# Altium schematic sheet PA_Encoder.SchDoc
size A1
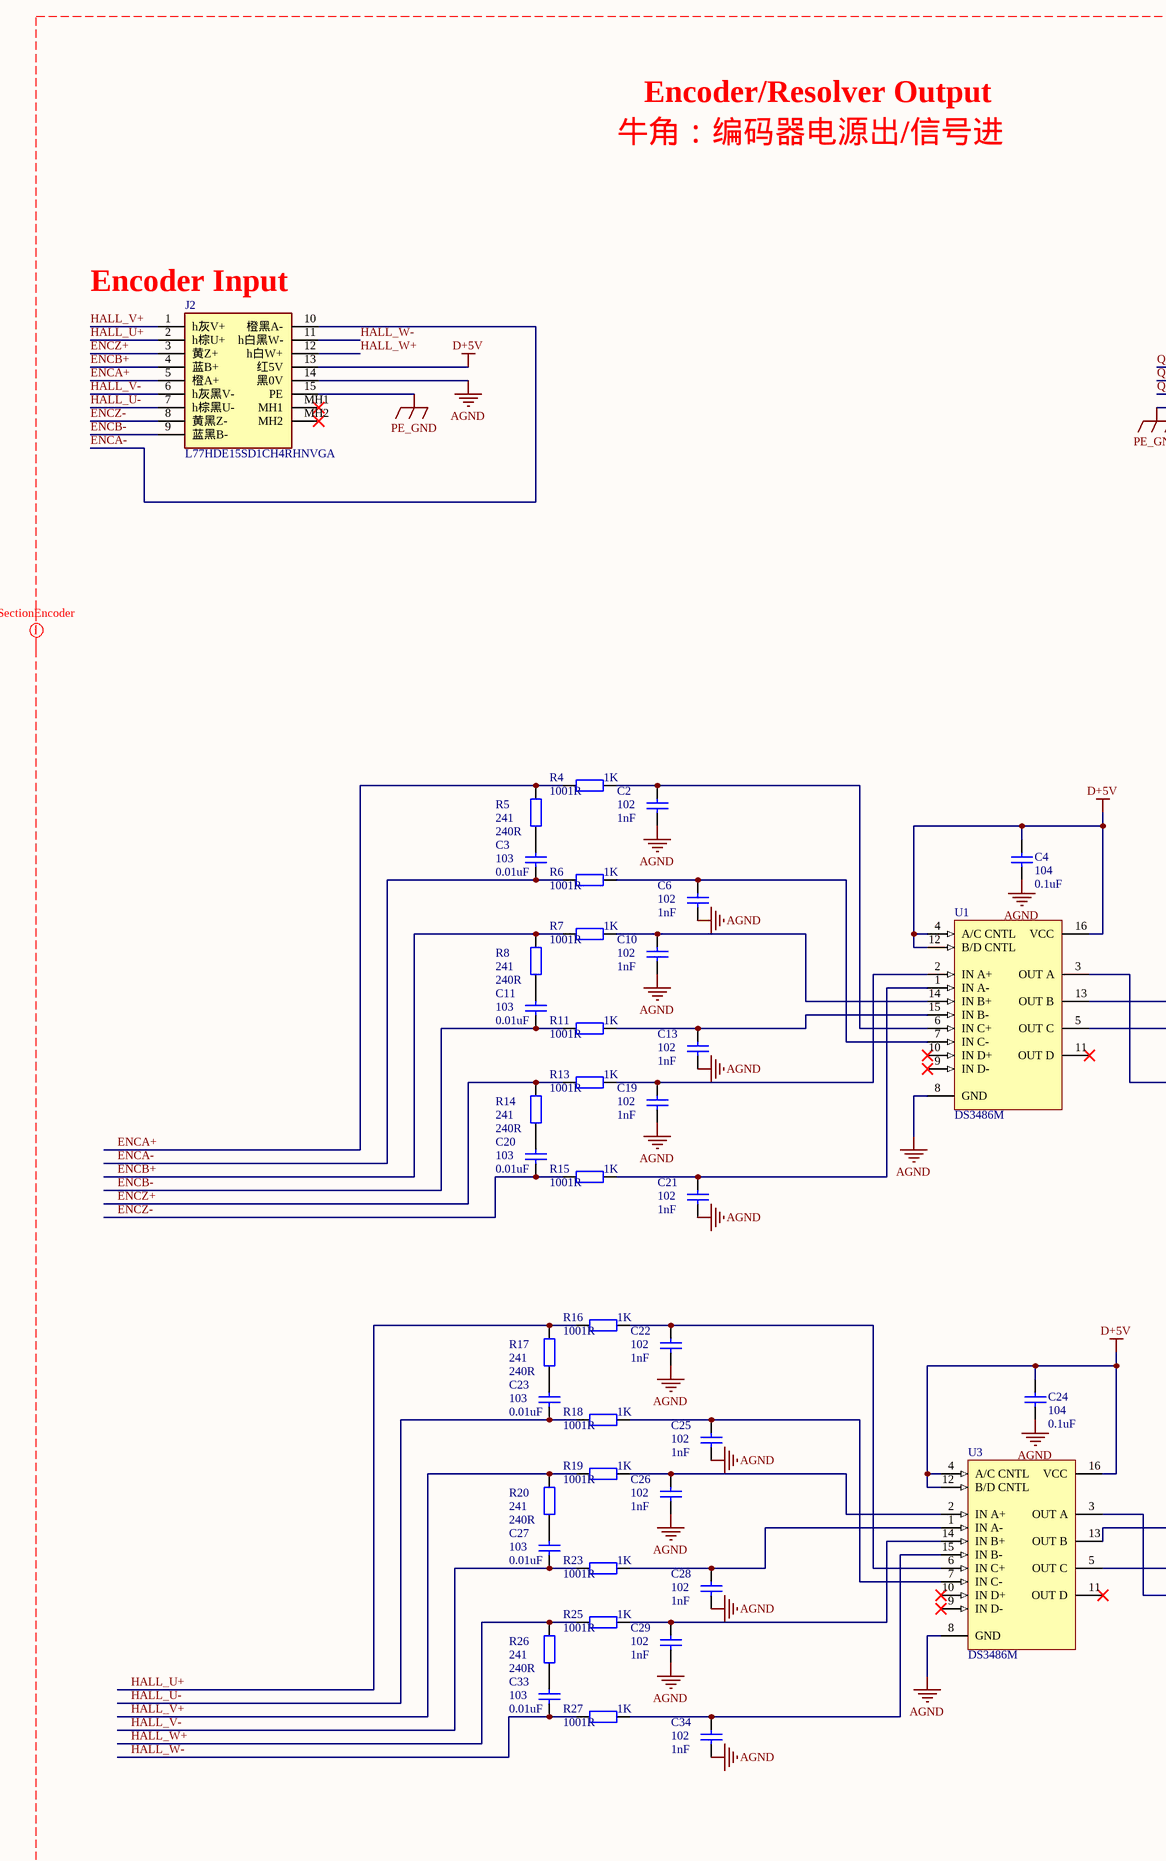
[diagram p0: PA_Encoder.SchDoc, left]
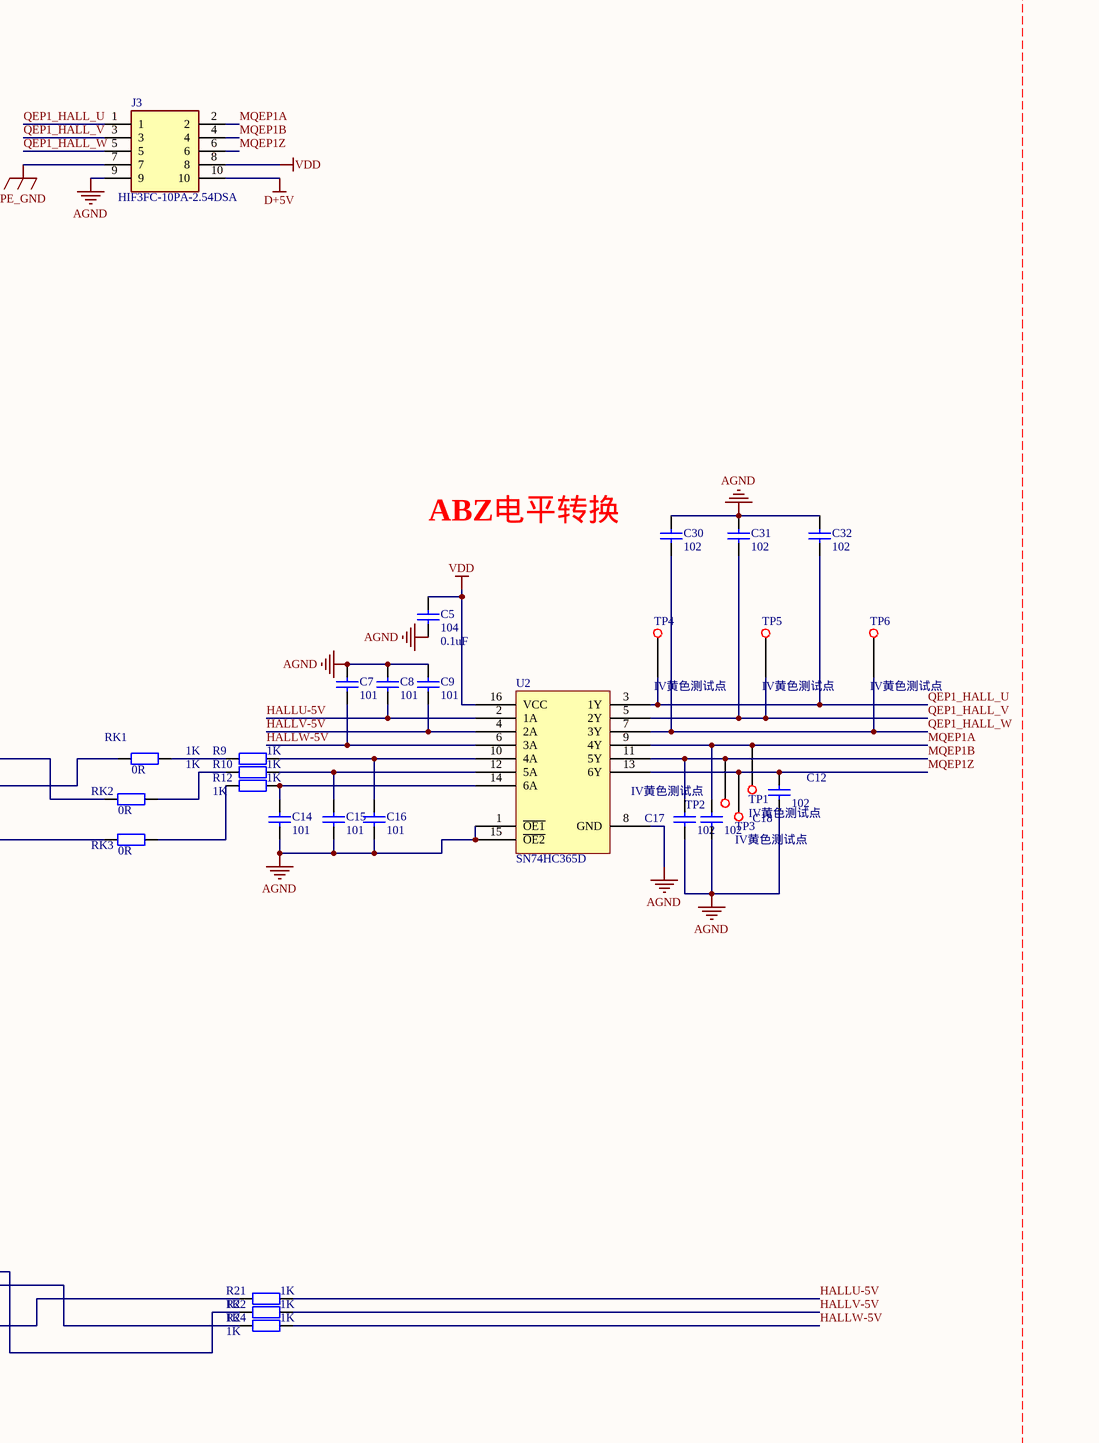
[diagram p1: PA_Encoder.SchDoc, middle]

## Parts
C2  102  value 1nF  [0805]
C3  103  value 0.01uF  [0805]
C4  104  value 0.1uF  [0805]
C5  104  value 0.1uF  [0805]
C6  102  value 1nF  [0805]
C7  101  [0805]
C8  101  [0805]
C9  101  [0805]
C10  102  value 1nF  [0805]
C11  103  value 0.01uF  [0805]
C12  102  [0805]
C13  102  value 1nF  [0805]
C14  101  [0805]
C15  101  [0805]
C16  101  [0805]
C17  102  [0805]
C18  102  [0805]
C19  102  value 1nF  [0805]
C20  103  value 0.01uF  [0805]
C21  102  value 1nF  [0805]
C22  102  value 1nF  [0805]
C23  103  value 0.01uF  [0805]
C24  104  value 0.1uF  [0805]
C25  102  value 1nF  [0805]
C26  102  value 1nF  [0805]
C27  103  value 0.01uF  [0805]
C28  102  value 1nF  [0805]
C29  102  value 1nF  [0805]
C30  102  [0805]
C31  102  [0805]
C32  102  [0805]
C33  103  value 0.01uF  [0805]
C34  102  value 1nF  [0805]
J2  L77HDE15SD1CH4RHNVGA  [L77hde15sd1ch4rhnvga]
J3  HIF3FC-10PA-2.54DSA  [HIF3FC-10PA-2.54DSA]
R4  1001R  value 1K  [0805]
R5  241  value 240R  [0805]
R6  1001R  value 1K  [0805]
R7  1001R  value 1K  [0805]
R8  241  value 240R  [0805]
R9  1K  [0805]
R10  1K  [0805]
R11  1001R  value 1K  [0805]
R12  1K  [0805]
R13  1001R  value 1K  [0805]
R14  241  value 240R  [0805]
R15  1001R  value 1K  [0805]
R16  1001R  value 1K  [0805]
R17  241  value 240R  [0805]
R18  1001R  value 1K  [0805]
R19  1001R  value 1K  [0805]
R20  241  value 240R  [0805]
R21  1K  [0805]
R22  1K  [0805]
R23  1001R  value 1K  [0805]
R24  1K  [0805]
R25  1001R  value 1K  [0805]
R26  241  value 240R  [0805]
R27  1001R  value 1K  [0805]
RK1  0R  [0805]
RK2  0R  [0805]
RK3  0R  [0805]
TP1  IV黄色测试点  [TP]
TP2  IV黄色测试点  [TP]
TP3  IV黄色测试点  [TP]
TP4  IV黄色测试点  [TP]
TP5  IV黄色测试点  [TP]
TP6  IV黄色测试点  [TP]
U1  DS3486M  [M16A_N]
U2  SN74HC365D  [D016_N]
U3  DS3486M  [M16A_N]

## Nets
AGND: C2.1 C4.1 C5.2 C6.1 C7.1 C8.1 C9.1 C10.1 C12.2 C13.1 C14.2 C15.2 C16.2 C17.2 C18.2 C19.1 C21.1 C22.1 C24.1 C25.1 C26.1 C28.1 C29.1 C30.2 C31.2 C32.2 C34.1 J2.14(黑0V) J3.9 U1.8(GND) U2.1(~{OE1}) U2.8(GND) U2.15(~{OE2}) U3.8(GND)
D+5V: C4.2 C24.2 J2.13(红5V) J3.10 U1.4(A/C_CNTL) U1.12(B/D_CNTL) U1.16(VCC) U3.4(A/C_CNTL) U3.12(B/D_CNTL) U3.16(VCC)
PE_GND: J2.15(PE) J3.7
VDD: C5.1 J3.8 U2.16(VCC)
ENCA+: J2.5(橙A+) R4.1 R5.2
ENCA-: C3.1 J2.10(橙黑A-) R6.1
ENCB+: J2.4(蓝B+) R7.1 R8.2
ENCB-: C11.1 J2.9(蓝黑B-) R11.1
ENCZ+: J2.3(黄Z+) R13.1 R14.2
ENCZ-: C20.1 J2.8(黄黑Z-) R15.1
HALL_U+: J2.2(h棕U+) R16.1 R17.2
HALL_U-: C23.1 J2.7(h棕黑U-) R18.1
HALL_V+: J2.1(h灰V+) R19.1 R20.2
HALL_V-: C27.1 J2.6(h灰黑V-) R23.1
HALL_W+: J2.12(h白W+) R25.1 R26.2
HALL_W-: C33.1 J2.11(h白黑W-) R27.1
HALLU-5V: C8.2 R21.2 U2.2(1A)
HALLV-5V: C9.2 R22.2 U2.4(2A)
HALLW-5V: C7.2 R24.2 U2.6(3A)
MQEP1A: C18.1 J3.2 TP1.1 U2.9(4Y)
MQEP1B: C17.1 J3.4 TP2.1 U2.11(5Y)
MQEP1Z: C12.1 J3.6 TP3.1 U2.13(6Y)
QEP1_HALL_U: C32.1 J3.1 TP4.1 U2.3(1Y)
QEP1_HALL_V: C31.1 J3.3 TP5.1 U2.5(2Y)
QEP1_HALL_W: C30.1 J3.5 TP6.1 U2.7(3Y)
NetC2_2: C2.2 R4.2 U1.6(IN_C+)
NetC3_2: C3.2 R5.1
NetC6_2: C6.2 R6.2 U1.7(IN_C-)
NetC10_2: C10.2 R7.2 U1.14(IN_B+)
NetC11_2: C11.2 R8.1
NetC13_2: C13.2 R11.2 U1.15(IN_B-)
NetC14_1: C14.1 R12.2 U2.14(6A)
NetC15_1: C15.1 R10.2 U2.12(5A)
NetC16_1: C16.1 R9.2 U2.10(4A)
NetC19_2: C19.2 R13.2 U1.2(IN_A+)
NetC20_2: C20.2 R14.1
NetC21_2: C21.2 R15.2 U1.1(IN_A-)
NetC22_2: C22.2 R16.2 U3.6(IN_C+)
NetC23_2: C23.2 R17.1
NetC25_2: C25.2 R18.2 U3.7(IN_C-)
NetC26_2: C26.2 R19.2 U3.2(IN_A+)
NetC27_2: C27.2 R20.1
NetC28_2: C28.2 R23.2 U3.1(IN_A-)
NetC29_2: C29.2 R25.2 U3.14(IN_B+)
NetC33_2: C33.2 R26.1
NetC34_2: C34.2 R27.2 U3.15(IN_B-)
NetR9_1: R9.1 RK1.2
NetR10_1: R10.1 RK2.2
NetR12_1: R12.1 RK3.2
NetR21_1: R21.1 U3.5(OUT_C)
NetR22_1: R22.1 U3.3(OUT_A)
NetR24_1: R24.1 U3.13(OUT_B)
NetRK1_1: RK1.1 U1.5(OUT_C)
NetRK2_1: RK2.1 U1.13(OUT_B)
NetRK3_1: RK3.1 U1.3(OUT_A)

Not connected (* = marked no-connect by the designer): J2 MH1* MH2*; U1 9(IN_D-)* 10(IN_D+)* 11(OUT_D)*; U3 9(IN_D-)* 10(IN_D+)* 11(OUT_D)*

## Layout directives
net class SectionEncoder: AGND, D+5V, ENCA+, ENCA-, ENCB+, ENCB-, ENCZ+, ENCZ-, HALL_U+, HALL_U-, HALL_V+, HALL_V-, HALL_W+, HALL_W-, HALLU-5V, HALLV-5V, HALLW-5V, MQEP1A, MQEP1B, MQEP1Z, PE_GND, QEP1_HALL_U, QEP1_HALL_V, QEP1_HALL_W, VDD

## Notes on the sheet
- Encoder/Resolver Output
- 牛角：编码器电源出/信号进
- (near J2) Encoder Input
- ABZ电平转换

## Library data of the parts
C2-C34 = Cap: Capacitor; Published: 8-Jun-2000; LatestRevisionDate: 17-Jul-2002; LatestRevisionNote: Re-released for DXP Platform.; PackageReference: RAD-0.3; Publisher: Altium Limited; ClassName: Encoder
J2 = VGA_母头_时代超群15线编码器定义: Connector; Manufacturer_Name: Amphenol; Datasheet Link: https://componentsearchengine.com/Datasheets/1/L77HDE15SD1CH4RHNVGA.pdf; Height: 12.55mm; Manufacturer_Part_Number: L77HDE15SD1CH4RHNVGA; Mouser Part Number: 523-7HDE15SDH4RHNVGA; Mouser Price/Stock: https://www.mouser.co.uk/ProductDetail/Amphenol-Commercial-Products/L77HDE15SD1CH4RHNVGA?qs=f9yNj16SXrKPVxRw%2FcVQYg%3D%3D; Arrow Part Number: L77HDE15SD1CH4RHNVGA; Arrow Price/Stock: https://www.arrow.com/en/products/l77hde15sd1ch4rhnvga/amphenol-fci?region=nac
J3 = HIF3FC-10PA-2.54DSA: Connector; Manufacturer_Name: Hirose; Manufacturer_Part_Number: HIF3FC-10PA-2.54DSA(71); Datasheet Link: https://componentsearchengine.com/Datasheets/1/HIF3FC-10PA-2.54DSA(71).pdf; Height: 9.2mm; Mouser Part Number: 798-HIF3FC10PA254D71; Mouser Price/Stock: https://www.mouser.co.uk/ProductDetail/Hirose-Connector/HIF3FC-10PA-2.54DSA71?qs=eDUdFcBPps26f2LJxn%252B8VA%3D%3D
R4-R27 = Res2: Resistor; Published: 8-Jun-2000; LatestRevisionDate: 17-Jul-2002; LatestRevisionNote: Re-released for DXP Platform.; PackageReference: AXIAL-0.4; Publisher: Altium Limited; ClassName: Encoder
  R9 R10 R12 R21 R22 R24: Value: 1K
RK1-RK3 = Res2: Resistor; Value: 3.3K; Published: 8-Jun-2000; LatestRevisionDate: 17-Jul-2002; LatestRevisionNote: Re-released for DXP Platform.; PackageReference: AXIAL-0.4; Publisher: Altium Limited; PackageDescription: Axial Device, Thru-Hole; 2 Leads; 0.4 in Pin Spacing; ClassName: Encoder
TP1-TP6 = 测试点: ClassName: Encoder
U1 U3 = DS3486M: Quad RS-422, RS-423 Line Receiver; Published: 15-Apr-2002; LatestRevisionDate: 13-Apr-2006; LatestRevisionNote: IPC-7351 Footprint Added.; DatasheetVersion: May-1998; PackageVersion: 2000; PackageReference: M16A; Publisher: Altium Limited; PackageDescription: 16-Pin Small Outline Integrated Circuit 1.27 mm Pitch; Code_IPC: SOIC127P600-16; ComponentLink1Description: Manufacturer Link; ComponentLink1URL: http://www.national.com/; ComponentLink2Description: Datasheet; ComponentLink2URL: http://www.national.com/ds.cgi/DS/DS3486.pdf; ComponentLink3Description: URL Link1; ComponentLink3URL: http://www.national.com/pf/DS/DS3486.html; ClassName: Encoder
U2 = SN74HC365D: ClassName: Encoder